# EAGLE design eib-64-intan-hs (EAGLE 8.3.2)
DESIGNER: OPEN-EPHYS; DESIGN_NAME: 2x64_hirose-circular; LICENSE: CERN OHL v1.2; REVISION: 1.0
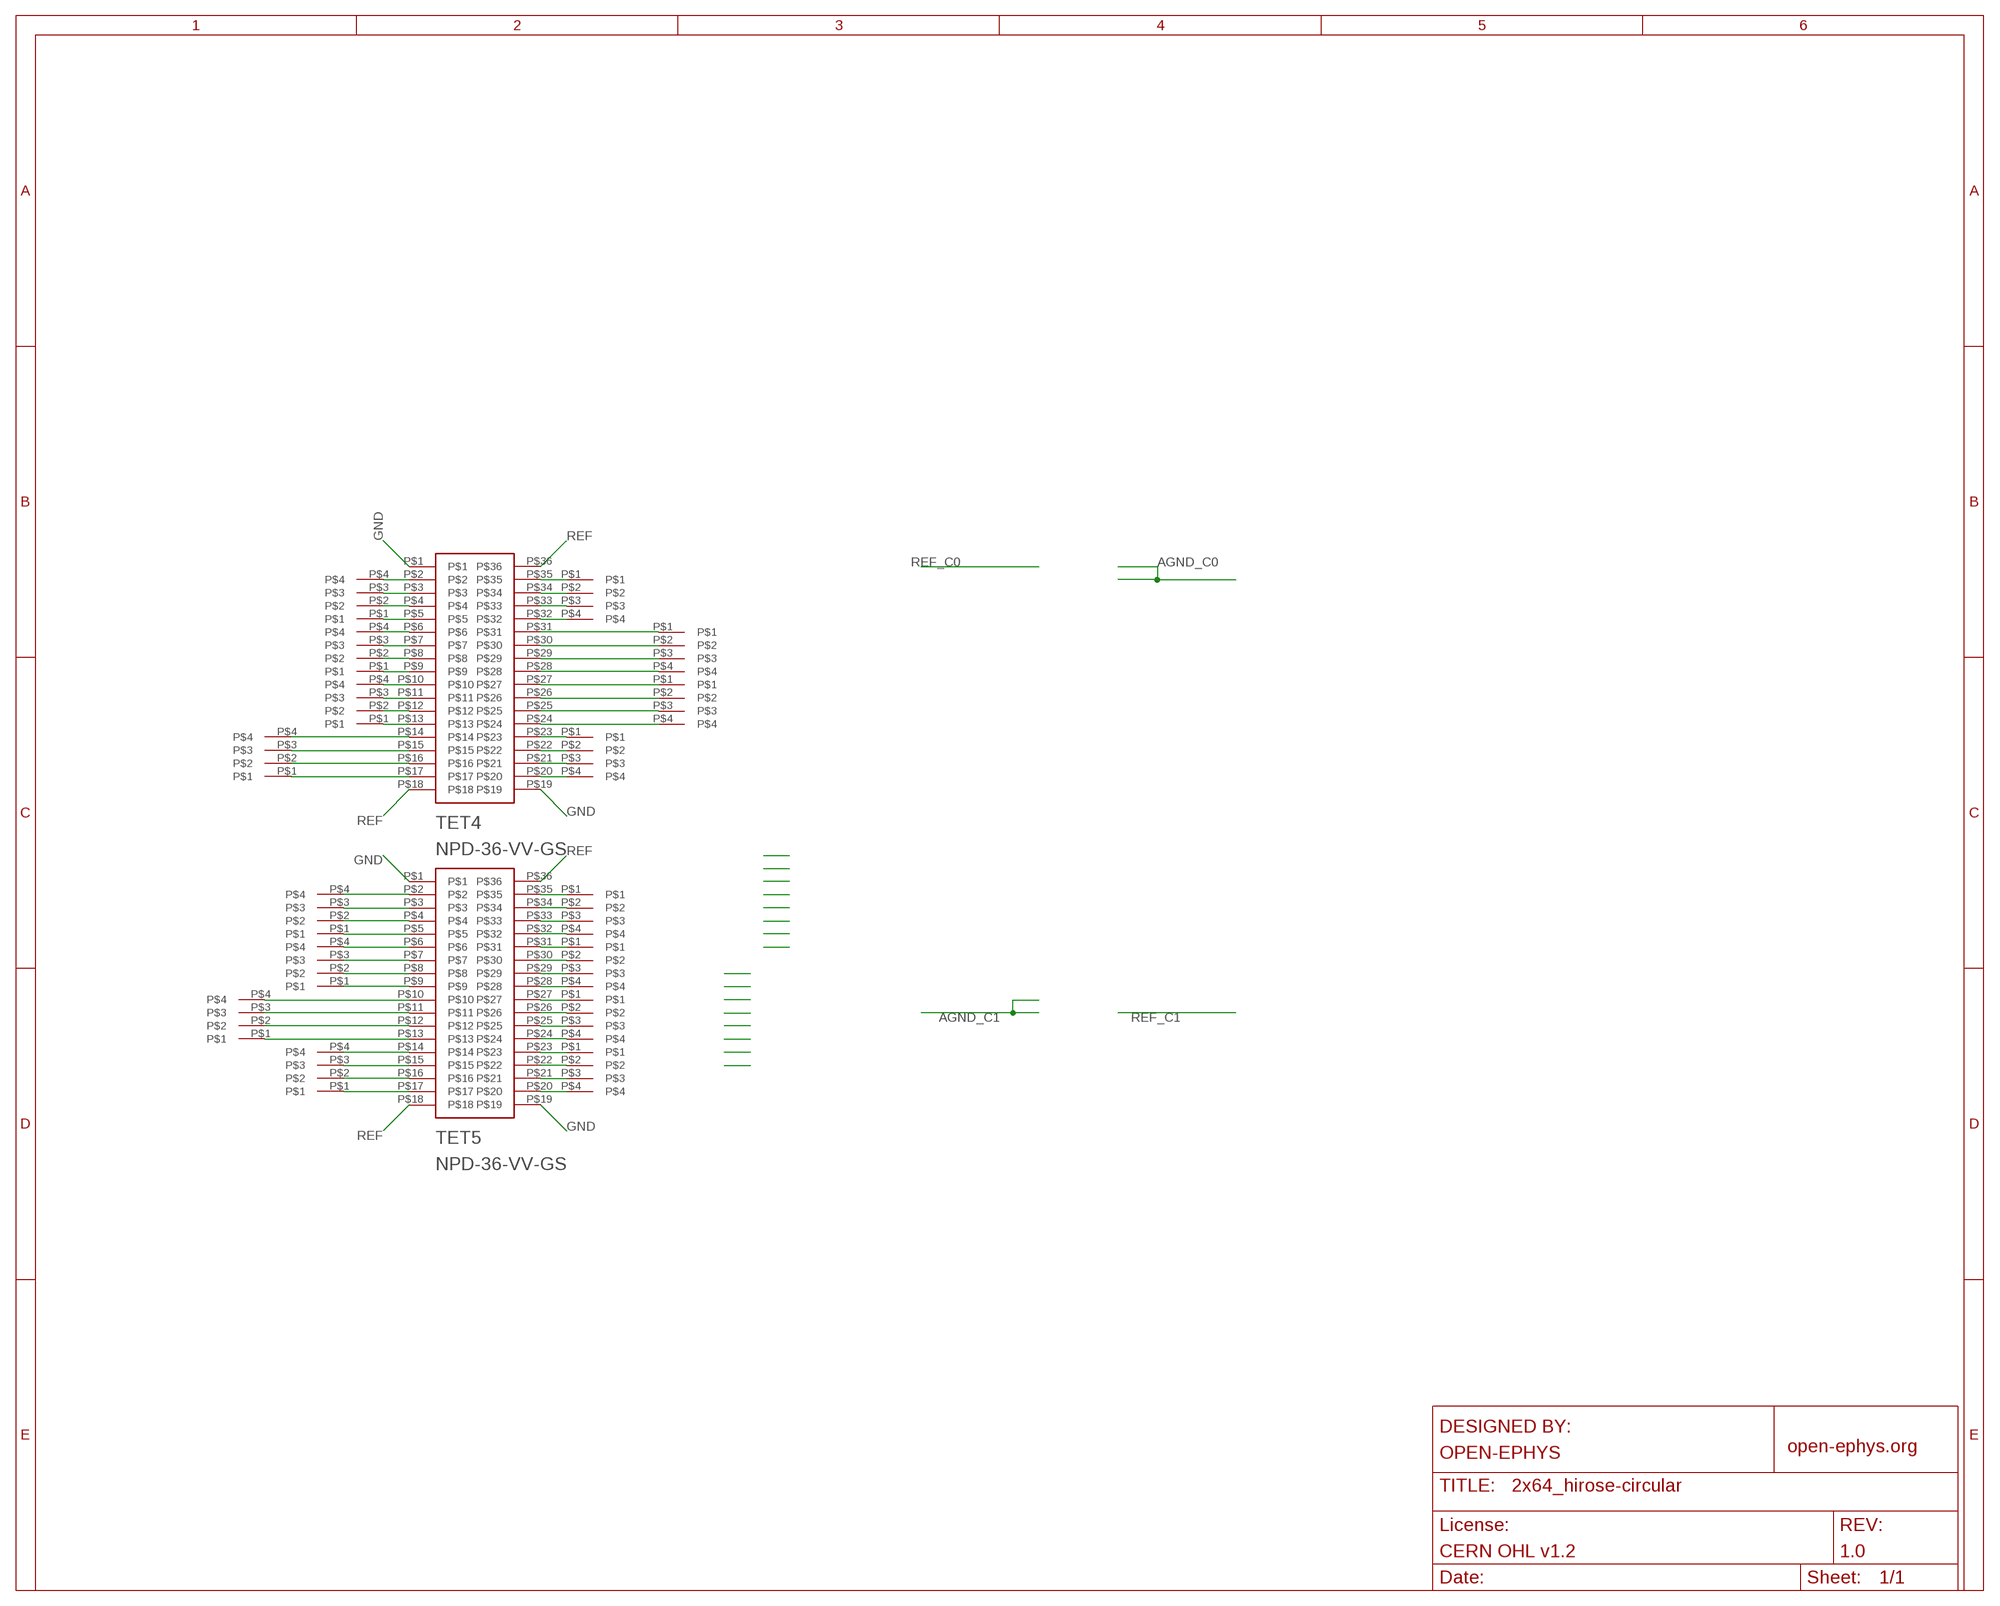
[diagram p0: schematic, sheet 1]

## Parts
TET0  0  TET32  [TET32]
TET1  1  TET32  [TET32]
TET2  2  TET32  [TET32]
TET3  3  TET32  [TET32]
TET4  NPD-36-VV-GS  [NPD-36-VV-GS]
TET5  NPD-36-VV-GS  [NPD-36-VV-GS]
TET8  8  TET32  [TET32]
TET9  9  TET32  [TET32]
TET10  10  TET32  [TET32]
TET11  11  TET32  [TET32]
TET12  12  TET32  [TET32]
TET13  13  TET32  [TET32]
TET14  14  TET32  [TET32]
TET15  15  TET32  [TET32]
TET20  20  TET32  [TET32]
TET21  21  TET32  [TET32]
TET22  22  TET32  [TET32]
TET23  23  TET32  [TET32]

## Nets
GND: TET4.P$1 TET4.P$19 TET5.P$1 TET5.P$19
N$1: TET5.P$6 TET9.P$4
N$3: TET5.P$2 TET8.P$4
N$4: TET5.P$3 TET8.P$3
N$5: TET5.P$4 TET8.P$2
N$6: TET5.P$5 TET8.P$1
N$7: TET5.P$7 TET9.P$3
N$8: TET5.P$8 TET9.P$2
N$9: TET5.P$9 TET9.P$1
N$10: TET5.P$10 TET14.P$4
N$11: TET5.P$11 TET14.P$3
N$12: TET5.P$28 TET11.P$4
N$13: TET5.P$27 TET12.P$1
N$14: TET5.P$26 TET12.P$2
N$15: TET5.P$25 TET12.P$3
N$16: TET5.P$24 TET12.P$4
N$17: TET5.P$23 TET13.P$1
N$18: TET5.P$22 TET13.P$2
N$19: TET5.P$21 TET13.P$3
N$21: TET5.P$35 TET10.P$1
N$22: TET5.P$34 TET10.P$2
N$23: TET5.P$33 TET10.P$3
N$24: TET5.P$32 TET10.P$4
N$25: TET5.P$31 TET11.P$1
N$26: TET5.P$30 TET11.P$2
N$27: TET5.P$29 TET11.P$3
N$36: TET5.P$12 TET14.P$2
N$37: TET5.P$13 TET14.P$1
N$38: TET5.P$14 TET15.P$4
N$39: TET5.P$15 TET15.P$3
N$40: TET5.P$16 TET15.P$2
N$41: TET5.P$17 TET15.P$1
N$44: TET1.P$4 TET4.P$2
N$45: TET1.P$3 TET4.P$3
N$46: TET1.P$2 TET4.P$4
N$47: TET1.P$1 TET4.P$5
N$48: TET0.P$4 TET4.P$6
N$49: TET0.P$3 TET4.P$7
N$50: TET0.P$2 TET4.P$8
N$51: TET0.P$1 TET4.P$9
N$60: TET3.P$1 TET4.P$35
N$61: TET3.P$2 TET4.P$34
N$62: TET3.P$3 TET4.P$33
N$63: TET3.P$4 TET4.P$32
N$64: TET2.P$1 TET4.P$31
N$65: TET2.P$2 TET4.P$30
N$66: TET5.P$20 TET13.P$4
N$67: TET2.P$4 TET4.P$28
N$68: TET4.P$27 TET21.P$1
N$69: TET4.P$25 TET21.P$3
N$70: TET4.P$26 TET21.P$2
N$71: TET4.P$24 TET21.P$4
N$72: TET4.P$23 TET20.P$1
N$73: TET4.P$22 TET20.P$2
N$74: TET4.P$21 TET20.P$3
N$75: TET4.P$20 TET20.P$4
N$76: TET4.P$10 TET23.P$4
N$77: TET4.P$11 TET23.P$3
N$78: TET4.P$12 TET23.P$2
N$79: TET4.P$13 TET23.P$1
N$80: TET4.P$14 TET22.P$4
N$81: TET4.P$15 TET22.P$3
N$82: TET4.P$16 TET22.P$2
N$83: TET4.P$17 TET22.P$1
N$85: TET2.P$3 TET4.P$29
REF: TET4.P$18 TET4.P$36 TET5.P$18 TET5.P$36

## Library data of the parts
TET0 TET1-TET3 TET8-TET15 TET20-TET23 = tetrodes:TET32
TET4 TET5 = open-ephys:NPD-36-VV-GS: Omnetics 36-pin connector, vertical surface-mount

## Net classes
1 thick: width 0.102 mm

## Board
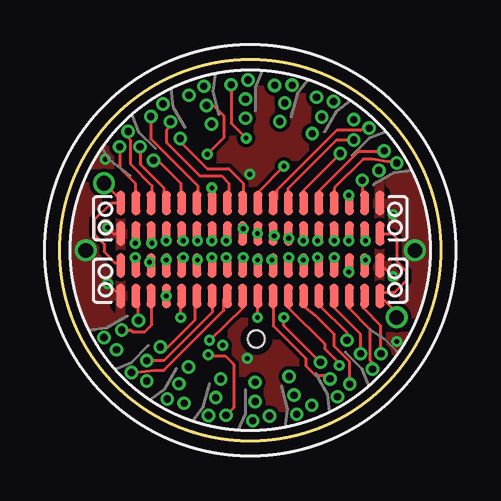
[diagram p1: board, top side]
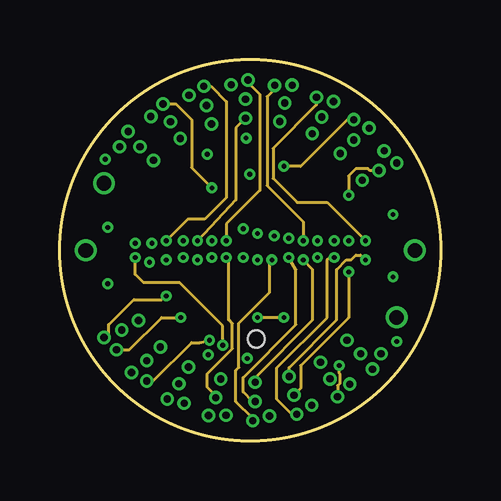
[diagram p2: board, inner layer Route2]
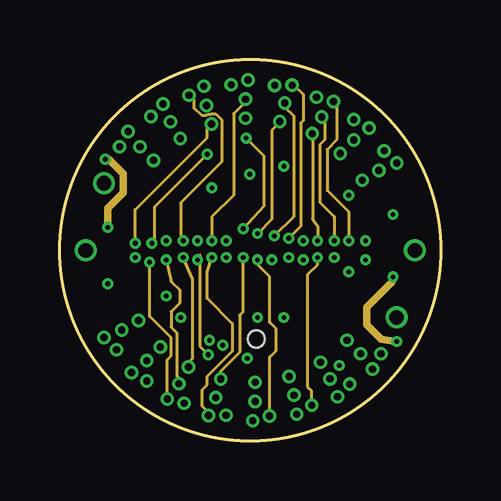
[diagram p3: board, inner layer Route3]
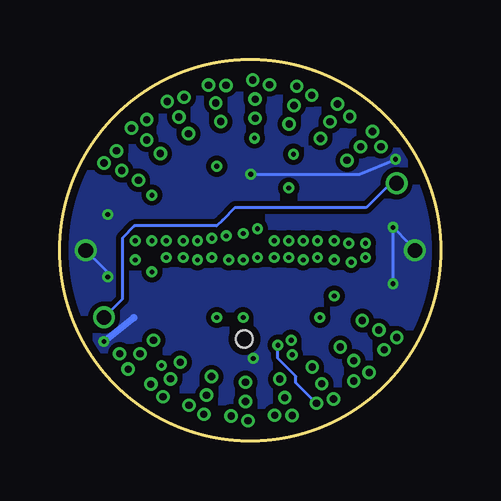
[diagram p4: board, bottom side, seen from below]

Size 15.86 x 15.86 mm. Coordinates in mm from the lower left corner, seen from the top.
Outline: circle at 7.93,7.93 radius 7.93
Copper layers (1*2+3*16): Top 0.035mm / dielectric 1.5mm / Route2 0.035mm / dielectric 0.15mm / Route3 0.035mm / dielectric 0.2mm / Bottom 0.035mm
Design rules "Precision-Image *": minimum track width 2mil, minimum drill 6mil, track to track 2mil, track to pad 2mil, pad to pad 2mil, via to via 2mil, smd to smd 2mil, copper to edge 12mil, drill to drill 15mil, minimum pad ring 5mil, minimum via ring 5mil, stop-mask expansion 2mil, vias tented up to drill 0mil, thermal gap 10mil
Holes 0.7 mm at 8.18,4.23

### Footprints (pad centres in the part's own frame; a part is rotated, then mirrored left to right if it is on the bottom)
TET32 = drill 0.3 pad 0.5: P$1 -0.8,6.9; P$2 -0.1,7.1; P$3 -0.2,6.3; P$4 -0.2,5.5
NPD-36-VV-GS = smd 0.381 x 1.016: P$1 0,0; P$2 0.635,0; P$3 1.27,0; P$4 1.905,0; P$5 2.54,0; P$6 3.175,0; P$7 3.81,0; P$8 4.445,0; P$9 5.08,0; P$10 5.715,0; P$11 6.35,0; P$12 6.985,0; P$13 7.62,0; P$14 8.255,0; P$15 8.89,0; P$16 9.525,0; P$17 10.16,0; P$18 10.795,0; P$19 10.795,1.27; P$20 10.16,1.27; P$21 9.525,1.27; P$22 8.89,1.27; P$23 8.255,1.27; P$24 7.62,1.27; P$25 6.985,1.27; P$26 6.35,1.27; P$27 5.715,1.27; P$28 5.08,1.27; P$29 4.445,1.27; P$30 3.81,1.27; P$31 3.175,1.27; P$32 2.54,1.27; P$33 1.905,1.27; P$34 1.27,1.27; P$35 0.635,1.27; P$36 0,1.27

### Placement (x,y rotation side)
TET0  7.93,7.93 0 top
TET1  7.93,7.93 15 top
TET2  7.93,7.93 30 top
TET3  7.93,7.93 45 top
TET4  2.53,8.63 0 top
TET5  2.53,6.03 0 top
TET8  7.93,7.93 120 top
TET9  7.93,7.93 135 top
TET10  7.93,7.93 150 top
TET11  7.93,7.93 165 top
TET12  7.93,7.93 180 top
TET13  7.93,7.93 195 top
TET14  7.93,7.93 210 top
TET15  7.93,7.93 225 top
TET20  7.93,7.93 300 top
TET21  7.93,7.93 315 top
TET22  7.93,7.93 330 top
TET23  7.93,7.93 345 top

### Tracks (layer width: path | path; a pad name or v marks a point on that pad's centre or on a via)
GND  (via drill 0.2, 0.61)
  Top 0.128: TET5.P$1 v1.98,6.54 | 13.85,9.39 v13.88,9.42 | v13.88,6.82 13.36,7.33 TET5.P$19 | v1.98,8.88 2.24,8.63 TET4.P$1
  Route3 0.305: v1.98,8.88 1.98,9.68 2.63,10.33 2.63,11.13 2.03,11.73 v1.88,11.73 | v13.88,6.82 13.88,6.73 13.83,6.6 12.78,5.55 12.78,4.83 13.38,4.23 v14.03,4.13 13.98,4.13
  Bottom 0.128: v1.98,6.54 v1.98,8.88 1.28,8.18 v1.07,7.93 | v13.88,6.82 13.93,7.08 v14.79,7.93 | v7.91,11.1 3.4,11.1 v1.88,11.73
  Bottom 0.305: 12.78,5.13 v14.03,4.13
  other vias: 7.8,3.43
  pour Top (isolate 0.152): 23.33,21.13 -3.34,19.56 -2.17,-5.57 23.33,-5.57
  pour Bottom (isolate 0.203): 15.93,-3.87 17.83,17.53 -4.01,18.32 -1.67,-3.27
N$1
  Top 0.128: TET9.P$4 4.5,3.9 5.63,5.03 5.63,5.96 TET5.P$6
N$3
  Top 0.128: TET8.P$4 3.27,5.93 TET5.P$2
N$4
  Top 0.128: TET8.P$3 2.95,4.61 3.03,4.53 3.53,4.53 3.83,4.83 3.83,6 TET5.P$3
N$5  (via drill 0.2)
  Top 0.128: v4.43,6.02 TET5.P$4
  Route2 0.128: TET8.P$2 2.03,4.49 2.03,4.83 3.08,5.88 4.23,5.88 4.38,6.02 v4.43,6.02
N$6  (via drill 0.2 pad 0.25)
  Top 0.128: v5.03,5.13 5.03,5.99 TET5.P$5
  Route2 0.128: TET8.P$1 2.89,3.79 4.23,5.13 v5.03,5.13
N$7
  Top 0.128: TET5.P$7 6.34,5.34 4.33,3.33 TET9.P$3
N$8
  Top 0.128: TET9.P$2 3.93,2.93 4.33,2.93 6.83,5.43 6.83,5.88 TET5.P$8
N$9  (via drill 0.2 pad 0.25)
  Top 0.128: v6.23,4.18 7.63,5.53 7.53,5.95 TET5.P$9
  Route2 0.128: TET9.P$1 3.88,2.48 5.48,4.08 5.83,4.08 v6.23,4.18
N$10  (via drill 0.2 pad 0.25)
  Top 0.128: TET14.P$4 9.33,4.79 v9.33,5.13 | v8.23,5.13 8.24,5.14 TET5.P$10
  Route2 0.128: v9.33,5.13 v8.23,5.13
N$11
  Top 0.128: TET5.P$11 8.88,4.78 10.23,3.43 10.23,3.13 10.63,2.73 11.1,2.73 TET14.P$3
N$12  (via drill 0.2 pad 0.25)
  Top 0.128: v7.63,7.63 7.53,7.48 TET5.P$28
  Route3 0.128: TET11.P$4 6.7,2.9 7.48,3.68 7.48,5.23 7.63,5.38 v7.63,7.63
N$13  (via drill 0.2 pad 0.25)
  Top 0.128: v8.23,7.53 8.23,7.31 TET5.P$27
  Route3 0.128: TET12.P$1 8.73,3.48 8.98,3.73 8.98,4.68 8.73,4.93 8.73,6.83 8.23,7.33 v8.23,7.53
N$14  (via drill 0.2 pad 0.25)
  Top 0.128: v8.83,7.53 8.83,7.35 TET5.P$26
  Route2 0.128: TET12.P$2 8.03,0.93 7.33,1.63 7.33,2.93 7.45,3.05 7.45,4.9 8.73,6.18 8.73,7.53 v8.83,7.53
N$15  (via drill 0.2 pad 0.25)
  Top 0.128: v9.53,7.63 9.53,7.48 TET5.P$25
  Route2 0.128: TET12.P$3 8.03,1.63 7.63,2.03 7.63,2.63 9.83,4.83 9.83,7.13 v9.53,7.63
N$16  (via drill 0.2 pad 0.25)
  Top 0.128: v10.13,7.53 10.13,7.32 TET5.P$24
  Route2 0.128: TET12.P$4 8.13,2.63 10.53,5.03 10.53,7.13 v10.13,7.53
N$17  (via drill 0.2 pad 0.25)
  Top 0.128: v10.73,7.63 10.73,7.35 TET5.P$23
  Route3 0.128: TET13.P$1 10.49,2.07 10.33,2.23 10.33,6.93 10.73,7.33 v10.73,7.63
N$18  (via drill 0.2 pad 0.25)
  Top 0.128: v11.43,7.63 11.43,7.49 TET5.P$22
  Route2 0.128: TET13.P$2 9.66,1.1 9.03,1.73 9.03,3.03 11.13,5.13 11.13,7.53 11.23,7.63 v11.43,7.63
N$19  (via drill 0.2 pad 0.25)
  Top 0.128: TET5.P$21 12.05,7.6 v12.03,7.03
  Route2 0.128: v12.03,7.03 12.03,5.13 10.03,3.13 10.03,2.17 TET13.P$3
N$21  (via drill 0.2, 0.2 pad 0.25)
  Top 0.128: v3.13,7.63 3.13,7.43 TET5.P$35
  Route2 0.128: v3.13,7.63 3.13,6.93 3.48,6.58 4.98,6.58 6.78,4.78 v6.78,3.98
  Bottom 0.128: TET10.P$1 6.03,2.41 6.03,2.68 6.78,3.43 v6.78,3.98 6.78,4.03
N$22  (via drill 0.2 pad 0.25)
  Top 0.128: v3.73,7.43 3.73,7.37 TET5.P$34
  Route3 0.128: v3.73,7.43 3.73,5.18 4.63,4.28 4.63,3.53 4.47,3.37 TET10.P$2
N$23  (via drill 0.2 pad 0.25)
  Top 0.128: v4.43,7.53 4.33,7.4 TET5.P$33
  Route3 0.128: TET10.P$3 4.95,2.61 4.88,2.68 4.88,4.48 4.63,4.73 4.63,5.38 4.98,5.73 4.98,6.28 4.63,6.63 v4.43,7.53
N$24  (via drill 0.2 pad 0.25)
  Top 0.128: v5.13,7.63 5.13,7.56 TET5.P$32
  Route3 0.128: TET10.P$4 5.35,3.25 5.53,3.43 5.53,6.73 v5.13,7.63
N$25  (via drill 0.2, 0.2 pad 0.25)
  Top 0.128: v5.73,7.53 5.73,7.32 TET5.P$31 | v6.18,3.58 6.38,3.53 6.88,3.53 7.23,3.18 7.23,1.37 TET11.P$1
  Route3 0.128: TET11.P$1 6.92,0.92 | v5.73,7.53 5.83,7.73 5.83,3.93 v6.18,3.58
N$26  (via drill 0.2 pad 0.25)
  Top 0.128: v6.33,7.63 6.23,7.41 TET5.P$30
  Route3 0.128: TET11.P$2 6.19,1.17 5.93,1.43 5.93,2.13 6.13,2.33 6.13,2.68 7.18,3.73 7.18,4.88 6.13,5.93 6.13,7.03 v6.33,7.63
N$27  (via drill 0.2 pad 0.25)
  Top 0.128: v6.93,7.63 6.93,7.34 TET5.P$29
  Route2 0.128: TET11.P$3 6.49,1.87 6.13,2.23 6.13,2.78 7.18,3.83 7.18,4.88 7.03,5.03 7.03,7.53 v6.93,7.63
N$36  (via drill 0.2 pad 0.25)
  Top 0.128: TET5.P$12 9.52,5.54 11.03,4.03 11.03,3.83 11.63,3.23 v11.63,3.13
  Route2 0.128: TET14.P$2 11.57,2.29 11.67,2.4 11.67,2.77 11.63,2.82 v11.63,3.13
N$37
  Top 0.128: TET14.P$1 12.07,3.29 11.43,3.93 11.43,4.43 10.63,5.23 10.13,5.63 10.13,6.01 TET5.P$13
N$38
  Top 0.128: TET15.P$4 11.96,4.5 10.83,5.63 10.83,5.98 TET5.P$14
N$39
  Top 0.128: TET15.P$3 12.53,3.73 12.53,4.43 11.43,5.53 TET5.P$15
N$40
  Top 0.128: TET15.P$2 13.02,3.24 12.93,3.33 12.93,4.63 12.03,5.53 12.03,6 TET5.P$16
N$41
  Top 0.128: TET15.P$1 13.38,4.79 12.63,5.53 12.63,5.97 TET5.P$17
N$44  (via drill 0.2 pad 0.25)
  Top 0.128: TET4.P$2 3.17,8.77 3.23,8.83 3.23,8.33 v3.13,8.23
  Route3 0.128: v3.13,8.23 3.13,9.63 6.13,12.63 6.13,13.01 TET1.P$4
N$45  (via drill 0.2 pad 0.25)
  Top 0.128: TET1.P$3 6.4,13.96 6.83,13.53 6.83,12.63 v6.13,11.93 | v3.83,8.23 3.83,8.6 TET4.P$3
  Route3 0.128: v6.13,11.93 3.93,9.73 3.93,8.13 v3.83,8.23
N$46  (via drill 0.2 pad 0.25)
  Top 0.128: v4.43,8.33 4.53,8.54 TET4.P$4
  Route2 0.128: TET1.P$2 6.3,14.76 6.93,14.13 6.93,10.13 6.03,9.23 5.33,9.23 v4.43,8.33
N$47  (via drill 0.2 pad 0.25)
  Top 0.128: 5.03,8.23 5.07,8.27 TET4.P$5 5.13,8.57 v5.13,8.33
  Route3 0.128: v5.13,8.33 5.03,8.23 5.03,9.91 6.73,11.62 6.73,13.36 6.49,13.61 6.37,13.61 6.26,13.58 6.24,13.59 6.05,13.54 5.93,13.54 5.59,13.84 5.59,14.2 5.45,14.39 TET1.P$1
N$48  (via drill 0.2 pad 0.25)
  Top 0.128: v5.73,8.33 5.73,8.61 TET4.P$6
  Route2 0.128: TET0.P$4 7.33,13.03 7.33,10.03 v5.73,8.33
N$49  (via drill 0.2 pad 0.25)
  Top 0.128: v6.33,8.33 6.34,8.43 TET4.P$7
  Route3 0.128: TET0.P$3 7.73,14.13 7.23,13.63 7.23,10.23 6.33,9.33 v6.33,8.33
N$50  (via drill 0.2 pad 0.25)
  Top 0.128: v6.93,8.33 6.93,8.58 TET4.P$8
  Route2 0.128: TET0.P$2 7.83,14.93 8.33,14.43 8.33,10.43 6.93,9.03 v6.93,8.33
N$51  (via drill 0.2 pad 0.25)
  Top 0.128: TET0.P$1 7.13,13.23 v7.75,12.61 | v7.63,8.83 7.63,8.65 TET4.P$9
  Route3 0.128: v7.75,12.61 8.49,11.87 8.49,9.76 v7.63,8.83
N$60
  Top 0.128: TET3.P$1 2.48,11.38 3.13,10.73 3.13,9.93 TET4.P$35
N$61
  Top 0.128: TET3.P$2 2.84,12.62 2.93,12.53 2.93,11.53 3.83,10.63 3.83,9.93 TET4.P$34
N$62
  Top 0.128: TET3.P$3 3.33,11.53 4.33,10.53 4.33,10 TET4.P$33
N$63
  Top 0.128: TET3.P$4 4.08,11.68 5.03,10.73 5.03,9.94 TET4.P$32
N$64
  Top 0.128: TET2.P$1 3.79,12.57 5.73,10.63 5.73,9.93 TET4.P$31
N$65  (via drill 0.2 pad 0.25)
  Top 0.128: v6.33,10.53 TET4.P$30
  Route2 0.128: TET2.P$2 4.83,14.03 5.48,13.38 5.48,11.38 v6.33,10.53
N$66  (via drill 0.2 pad 0.25)
  Top 0.128: v12.73,7.53 12.63,7.36 TET5.P$20
  Route2 0.128: TET13.P$4 9.55,3.05 11.53,5.03 11.53,7.13 11.93,7.53 12.13,7.53 12.33,7.73 12.53,7.73 v12.73,7.53
N$67
  Top 0.128: TET2.P$4 5.01,12.45 6.13,11.33 7.03,11.33 7.63,10.73 7.63,9.92 TET4.P$28
N$68  (via drill 0.2 pad 0.25)
  Top 0.128: v9.33,11.43 8.23,10.33 8.23,9.91 TET4.P$27
  Route2 0.128: TET21.P$1 11.97,13.38 10.03,11.43 v9.33,11.43
N$69
  Top 0.128: TET4.P$25 9.52,10.52 11.53,12.53 TET21.P$3
N$70
  Top 0.128: TET21.P$2 12.62,13.02 12.53,12.93 11.53,12.93 9.03,10.43 9.03,10.05 TET4.P$26
N$71
  Top 0.128: TET4.P$24 10.15,10.43 TET21.P$4
N$72
  Top 0.128: TET20.P$1 13.46,12.03 12.43,12.03 10.79,10.38 TET4.P$23
N$73
  Top 0.128: TET20.P$2 13.96,11.63 13.63,11.63 13.03,11.73 12.63,11.73 11.43,10.53 TET4.P$22
N$74  (via drill 0.2 pad 0.25)
  Top 0.128: v12.03,10.23 12.03,9.82 TET4.P$21
  Route2 0.128: TET20.P$3 12.91,11.25 12.83,11.33 12.33,11.33 12.03,11.03 v12.03,10.23
N$75
  Top 0.128: TET20.P$4 12.59,10 TET4.P$20
N$76  (via drill 0.2 pad 0.25)
  Top 0.128: v8.23,8.63 8.23,8.64 TET4.P$10
  Route3 0.128: TET23.P$4 9.16,13.26 8.83,12.93 8.83,9.23 v8.23,8.63
N$77  (via drill 0.2 pad 0.25)
  Top 0.128: v8.93,8.53 8.93,8.68 TET4.P$11
  Route3 0.128: TET23.P$3 9.37,13.89 9.73,13.53 9.73,9.33 v8.93,8.53
N$78  (via drill 0.2 pad 0.25)
  Top 0.128: v9.53,8.43 9.53,8.62 TET4.P$12
  Route3 0.128: TET23.P$2 9.75,14.81 10.13,14.43 10.13,13.33 10.03,13.23 10.03,8.93 v9.53,8.43
N$79  (via drill 0.2 pad 0.25)
  Top 0.128: v10.13,8.33 10.13,8.61 TET4.P$13
  Route2 0.128: TET23.P$1 8.94,14.64 8.63,14.33 8.63,10.63 10.13,9.13 v10.13,8.33
N$80  (via drill 0.2 pad 0.25)
  Top 0.128: v10.73,8.33 10.79,8.38 TET4.P$14
  Route3 0.128: TET22.P$4 10.53,12.77 10.53,9.23 10.73,8.93 v10.73,8.33
N$81  (via drill 0.2 pad 0.25)
  Top 0.128: v11.43,8.33 v11.42,8.34 TET4.P$15
  Route3 0.128: TET22.P$3 11.03,13.36 11.03,12.53 10.83,12.33 10.83,9.93 11.43,9.33 v11.43,8.33
N$82  (via drill 0.2 pad 0.25)
  Top 0.128: v12.03,8.33 12.15,8.36 TET4.P$16
  Route3 0.128: TET22.P$2 11.53,13.99 11.53,12.53 11.13,12.13 11.13,10.43 12.03,9.53 v12.03,8.33
N$83  (via drill 0.2 pad 0.25)
  Top 0.128: v12.73,8.33 12.73,8.59 TET4.P$17
  Route2 0.128: TET22.P$1 10.69,13.99 8.88,12.18 8.88,10.93 9.88,9.93 11.13,9.93 v12.73,8.33
  Route3 0.128: 12.71,8.35 v12.73,8.33
N$85
  Top 0.128: TET2.P$3 4.61,13.11 4.43,12.93 4.43,12.43 5.83,11.03 6.73,11.03 7.03,10.73 7.03,9.96 TET4.P$29
REF  (via drill 0.61)
  Top 0.128: TET4.P$18 13.83,8.63 14.03,8.44 14.03,7.48 14.43,7.07 14.43,6.66 13.93,6.15 13.45,6.15 TET5.P$18 14.03,5.33 v14.03,5.14 | TET5.P$36 2.41,7.42 2.28,7.42 1.83,7.87 1.83,8.18 1.43,8.59 1.43,9.2 2.13,9.9 TET4.P$36 2.53,10.15 2.6,10.22 2.34,10.22 v1.83,10.72
  Bottom 0.128: v1.83,10.72 2.09,10.72 3.1,9.71 8.57,9.71 9.09,9.19 9.33,8.95 12.76,8.95 13.26,8.44 13.26,5.9 v14.03,5.14

### Text on the board
tDocu: 3 | 4 | 5 | 6 | 2 | 7 | 1 | 8 | R | G | G | 1 | R | 6 | 1 | 1 | 9 | 5 | 1 | 1 | 0 | 4 | 1 | 1 | 1 | 3 | 2